# EasyEDA schematic easyeda_schematic.json
TITLE: Sheet_1; REV: 1.0; Date: 2020-08-18; Sheet: 1/1; Drawn By: mandreko; Company: Your Company
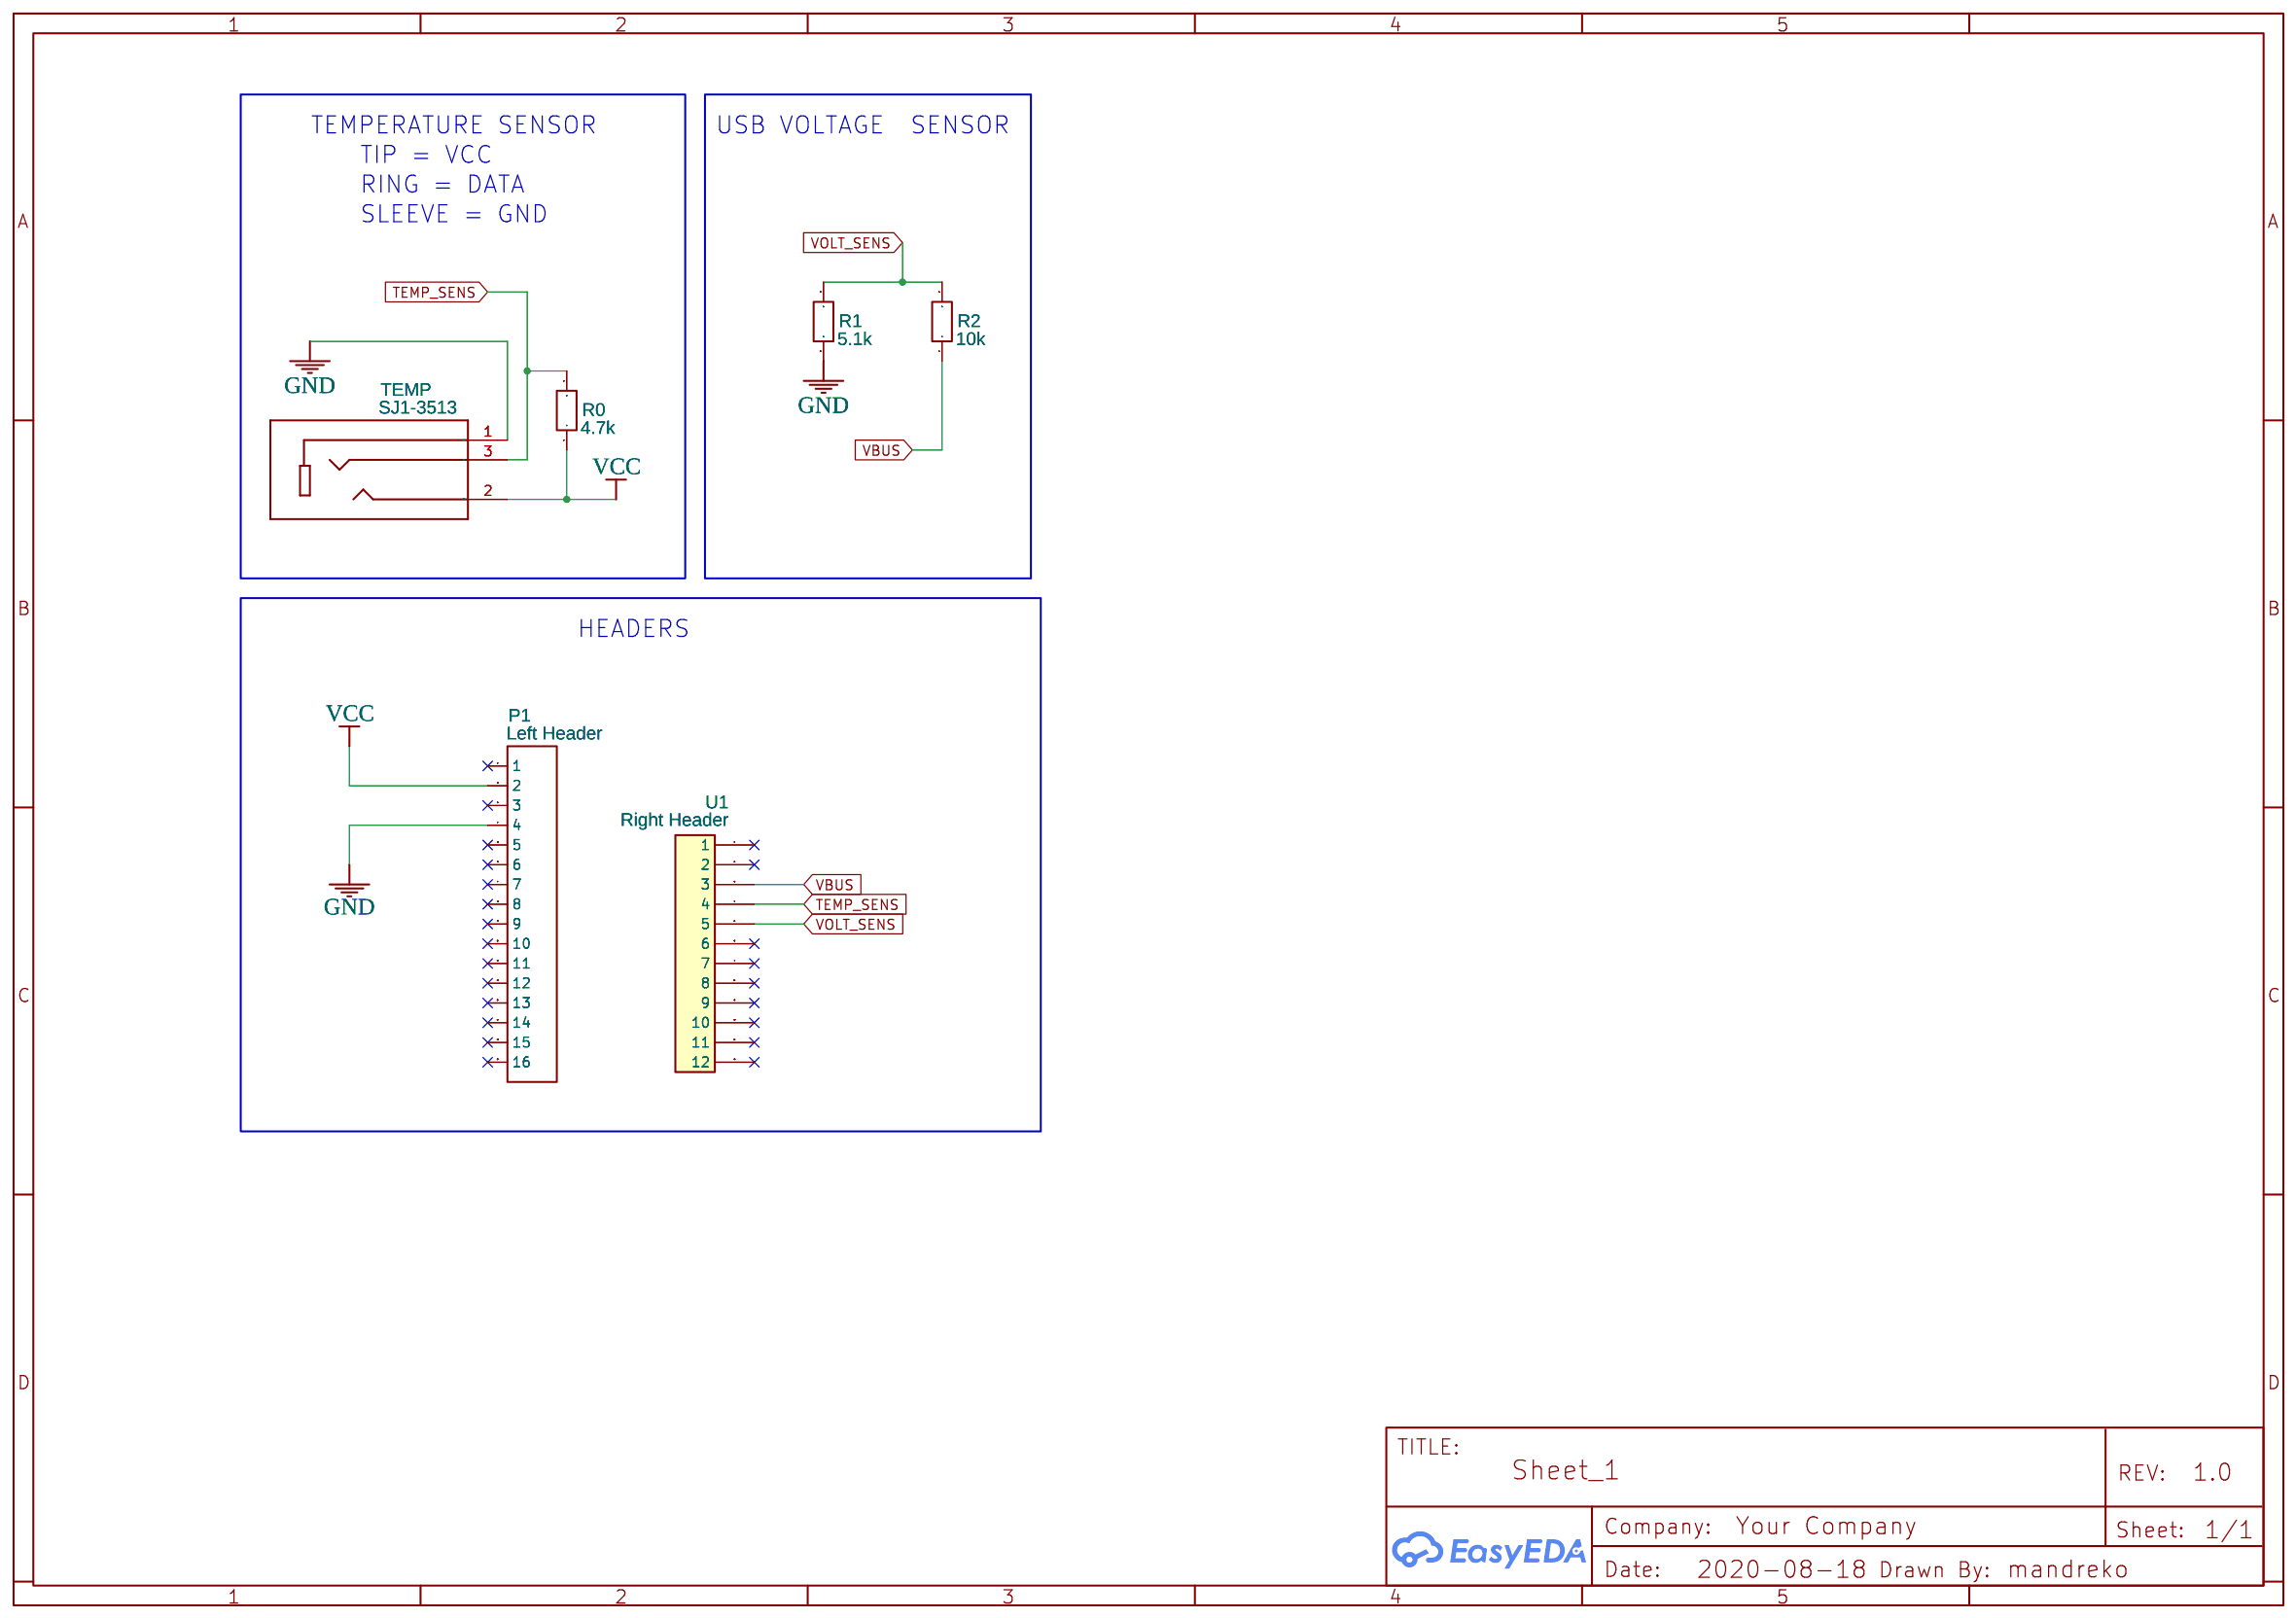
[diagram p0: schematic sheet]

## Parts
P1  Left Header  [HDR-TH_16P-P2.54-V]
R0  4.7k  [R0603]
R1  5.1k  [R0603]
R2  10k  [R0603]
TEMP  SJ1-3513  [CUI_SJ1-3513]
U1  Right Header  [HEADER-MALE-2.54_1X12]

## Library data of the parts
P1 = Header-Female-2.54_1x16: Supplier: LCSC; Manufacturer: BOOMELE; Manufacturer Part: Female header1*16P pitch 2.54mm; image: //image.lceda.cn/szlcsc/C66987.jpg; Supplier Part: C66987
R0-R2 = R_0603_EU: Contributor: LCEDA_Lib
TEMP = SJ1-3513: Contributor: Elijah Bouma-Sims
U1 = Header-Male-2.54_1x12: Contributor: caginpolat

## Nets
GND: P1.4 R1.1 TEMP.1
VBUS: R2.1 U1.3
VCC: P1.2 R0.1 TEMP.2
TEMP_SENS: R0.2 TEMP.3 U1.4
VOLT_SENS: R1.2 R2.2 U1.5

Not connected (* = marked no-connect by the designer): P1 1* 3* 5* 6* 7* 8* 9* 10* 11* 12* 13* 14* 15* 16*; U1 1* 2* 6* 7* 8* 9* 10* 11* 12*

## Notes on the sheet
- TEMPERATURE SENSOR
- USB VOLTAGE  SENSOR
- TIP = VCC
- RING = DATA
- SLEEVE = GND
- HEADERS
